# Altium schematic sheet Microcontroller.SchDoc
size A4
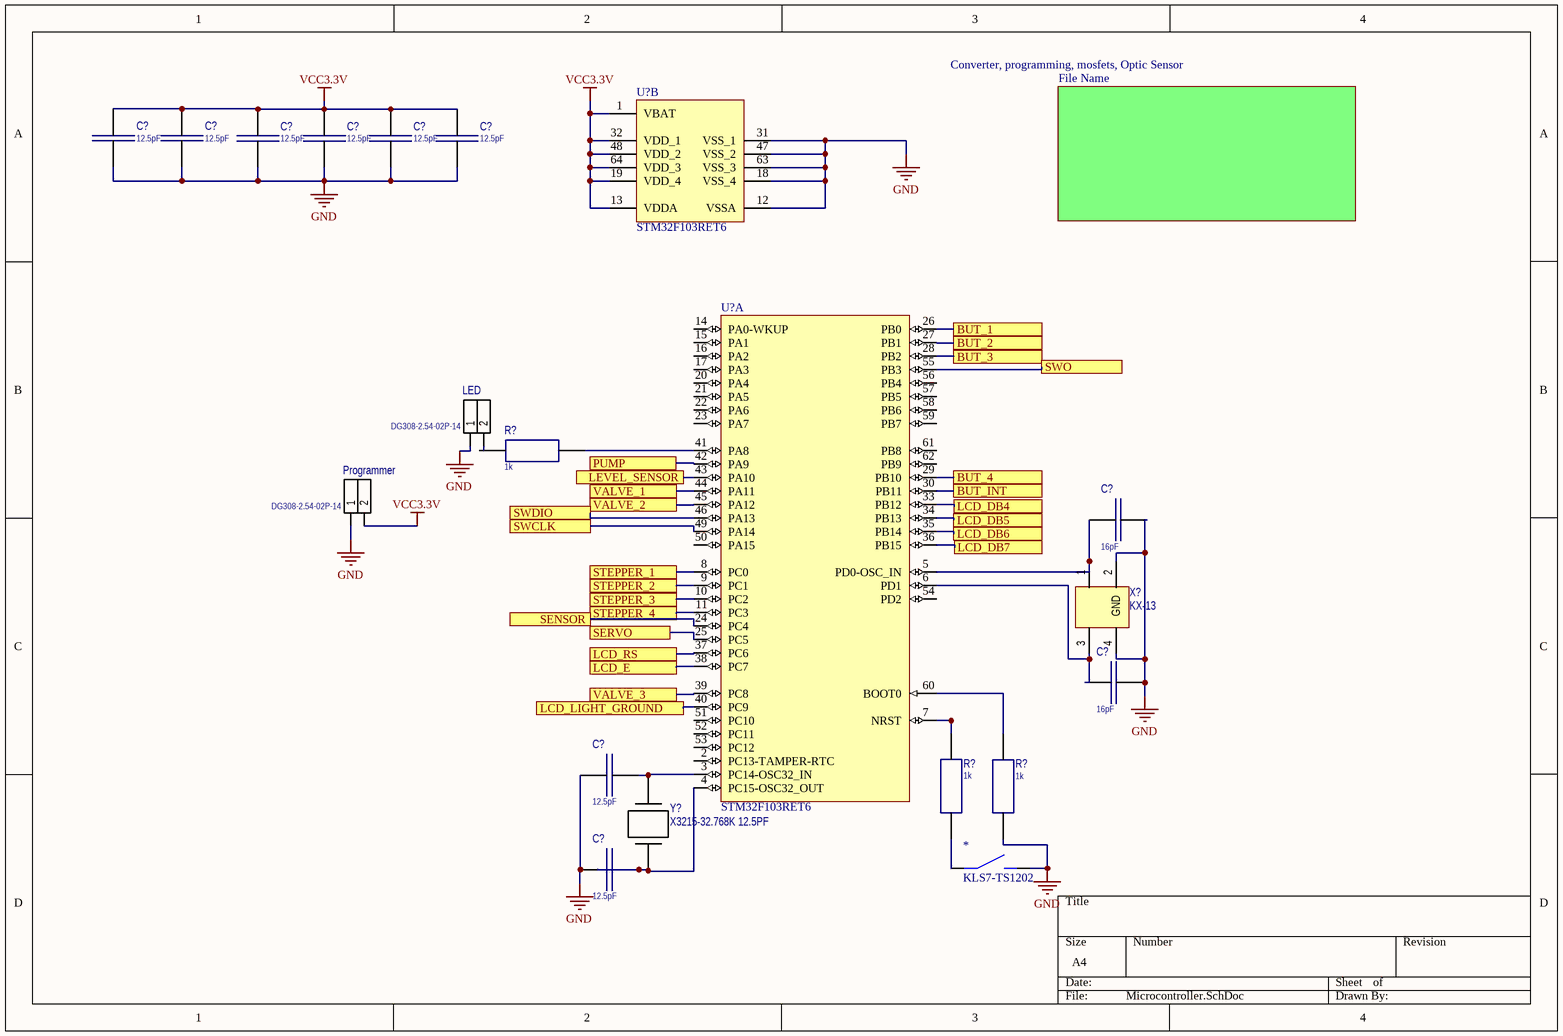
[diagram p0: Microcontroller.SchDoc]

## Parts
(Parts that share a designator on the sheet are numbered #1, #2 ... from top to bottom, then left to right.)
*  KLS7-TS1202  [KLS7-TS1202]
C?#1  12.5pF  [C_0805]
C?#2  12.5pF  [C_0805]
C?#3  12.5pF  [C_0805]
C?#4  12.5pF  [C_0805]
C?#5  12.5pF  [C_0805]
C?#6  12.5pF  [C_0805]
C?#7  16pF  [C_0805]
C?#8  16pF  [C_0805]
C?#9  12.5pF  [C_0805]
C?#10  12.5pF  [C_0805]
LED  DG308-2.54-02P-14  [DG308-2.54-02P-14]
Programmer  DG308-2.54-02P-14  [DG308-2.54-02P-14]
R?#1  1k  [R_0805]
R?#2  1k  [R_0805]
R?#3  1k  [R_0805]
U?#1  STM32F103RET6  [LQFP64_N]  (part B of 2)
U?#2  STM32F103RET6  [LQFP64_N]  (part A of 2)
X?  KX-13  [KX - 13]
Y?  X3215-32.768K 12.5PF  [x3215]

## Sub-sheets
Converter, programming, mosfets, Optic Sensor = File Name: no entries

## Ports
BUT_1, BUT_2, BUT_3, BUT_4, BUT_INT, LCD_DB4, LCD_DB5, LCD_DB6, LCD_DB7, LCD_E, LCD_LIGHT_GROUND, LCD_RS, LEVEL_SENSOR, PUMP, SENSOR, SERVO, STEPPER_1, STEPPER_2, STEPPER_3, STEPPER_4, SWCLK, SWDIO, SWO, VALVE_1, VALVE_2, VALVE_3

## Nets
GND: *.2 C?#1.2 C?#2.2 C?#3.2 C?#4.2 C?#5.2 C?#6.2 C?#7.1 C?#8.1 C?#9.2 C?#10.2 LED.1 Programmer.1 R?#3.2 U?#1.12(VSSA) U?#1.18(VSS_4) U?#1.31(VSS_1) U?#1.47(VSS_2) U?#1.63(VSS_3) X?.2(GND) X?.4
VCC3.3V: C?#1.1 C?#2.1 C?#3.1 C?#4.1 C?#5.1 C?#6.1 Programmer.2 U?#1.1(VBAT) U?#1.13(VDDA) U?#1.19(VDD_4) U?#1.32(VDD_1) U?#1.48(VDD_2) U?#1.64(VDD_3)
BUT_1: U?#2.26(PB0) ; port BUT_1
BUT_2: U?#2.27(PB1) ; port BUT_2
BUT_3: U?#2.28(PB2) ; port BUT_3
BUT_4: U?#2.29(PB10) ; port BUT_4
BUT_INT: U?#2.30(PB11) ; port BUT_INT
LCD_DB4: U?#2.33(PB12) ; port LCD_DB4
LCD_DB5: U?#2.34(PB13) ; port LCD_DB5
LCD_DB6: U?#2.35(PB14) ; port LCD_DB6
LCD_DB7: U?#2.36(PB15) ; port LCD_DB7
LCD_E: U?#2.38(PC7) ; port LCD_E
LCD_LIGHT_GROUND: U?#2.40(PC9) ; port LCD_LIGHT_GROUND
LCD_RS: U?#2.37(PC6) ; port LCD_RS
LEVEL_SENSOR: U?#2.43(PA10) ; port LEVEL_SENSOR
PUMP: U?#2.42(PA9) ; port PUMP
SENSOR: U?#2.24(PC4) ; port SENSOR
SERVO: U?#2.25(PC5) ; port SERVO
STEPPER_1: U?#2.8(PC0) ; port STEPPER_1
STEPPER_2: U?#2.9(PC1) ; port STEPPER_2
STEPPER_3: U?#2.10(PC2) ; port STEPPER_3
STEPPER_4: U?#2.11(PC3) ; port STEPPER_4
SWCLK: U?#2.49(PA14) ; port SWCLK
SWDIO: U?#2.46(PA13) ; port SWDIO
SWO: U?#2.55(PB3) ; port SWO
VALVE_1: U?#2.44(PA11) ; port VALVE_1
VALVE_2: U?#2.45(PA12) ; port VALVE_2
VALVE_3: U?#2.39(PC8) ; port VALVE_3
Net*_1: *.1 R?#2.2
NetC?#7_2: C?#7.2 U?#2.5(PD0-OSC_IN) X?.1
NetC?#8_2: C?#8.2 U?#2.6(PD1) X?.3
NetC?#9_1: C?#9.1 U?#2.3(PC14-OSC32_IN) Y?.1(OSC2)
NetC?#10_1: C?#10.1 U?#2.4(PC15-OSC32_OUT) Y?.0(OSC1)
NetR?#1_2: R?#1.2 U?#2.41(PA8)
NetR?#2_1: R?#2.1 U?#2.7(NRST)
NetR?#3_1: R?#3.1 U?#2.60(BOOT0)

Not connected (* = marked no-connect by the designer): LED 2; R?#1 1; U?#2 2(PC13-TAMPER-RTC) 14(PA0-WKUP) 15(PA1) 16(PA2) 17(PA3) 20(PA4) 21(PA5) 22(PA6) 23(PA7) 50(PA15) 51(PC10) 52(PC11) 53(PC12) 54(PD2) 56(PB4) 57(PB5) 58(PB6) 59(PB7) 61(PB8) 62(PB9)

## Library data of the parts
* = KLS7-TS1202: Button
C?#1-C?#10 = C0805: Capacitor
  C?#1-C?#6 C?#9 C?#10: Value: 12.5pF
  C?#7 C?#8: Value: 16pF
LED Programmer = DG308-2.54-02P-14: Connector 3Pin 2.54 pitch
R?#1-R?#3 = R0805: Resistor; Value: 1k
U?#1 U?#2 = STM32F103RET6: STM32 ARM-based 32-bit MCU Performance Line with 512 kB Flash, 64 kB Internal RAM, -40 to +85°C Temperature, 64-Pin LQFP, Tray; DatasheetVersion: rev8.0, Apr-2011; PackageVersion: rev13, Apr-2011; PackageReference: LQFP64; PackageDescription: 64-Pin Low-Profile Quad Flat Pack, 10 x 10 mm Body, 0.5 mm Pitch (LQFP64); ComponentLink1Description: Manufacturer URL; ComponentLink1URL: http://www.st.com/; ComponentLink2Description: STM32F103 Datasheet; ComponentLink2URL: http://www.st.com/internet/com/TECHNICAL_RESOURCES/TECHNICAL_LITERATURE/DATASHEET/CD00191185.pdf; ComponentLink3Description: STM32 Family Web Page; ComponentLink3URL: www.st.com/stm32
X? = KX-13: Quartz
Y? = Y_3215: Crystal Oscillator; Value: X3215-32.768K 12.5PF